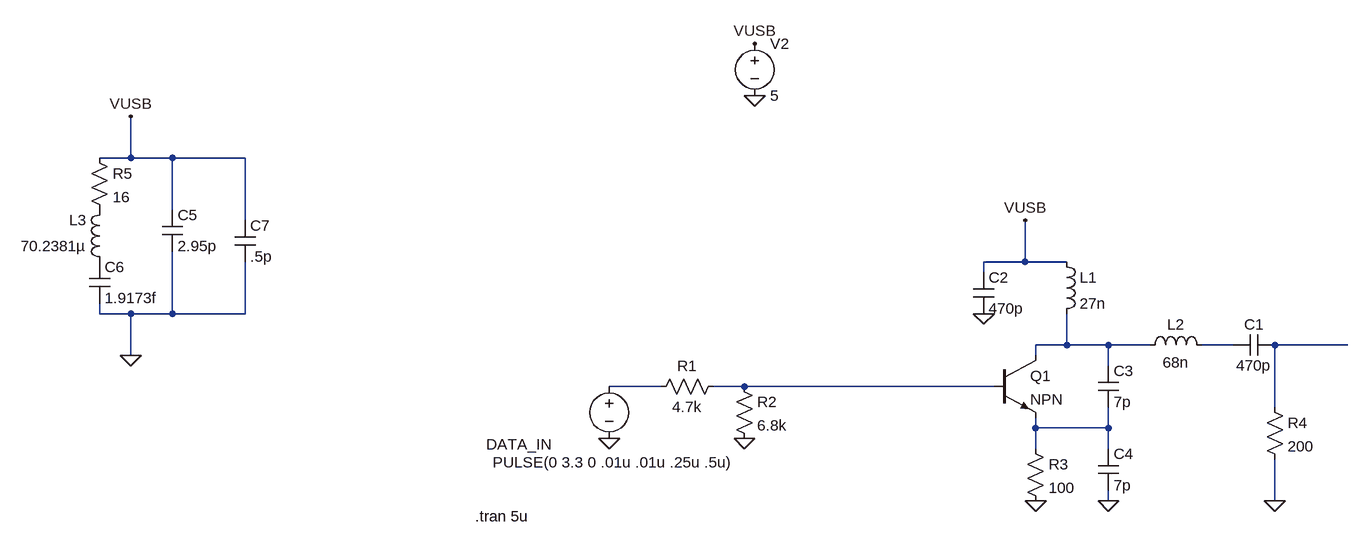
[diagram p0: schematic OOK_mod.asc]
OOK_mod.asc, the LTspice schematic file:
Version 4
SHEET 1 964 680
WIRE -912 48 -912 -16
WIRE -912 48 -960 48
WIRE -848 48 -912 48
WIRE -736 48 -848 48
WIRE -848 128 -848 48
WIRE -736 144 -736 48
WIRE 464 208 464 144
WIRE 464 208 400 208
WIRE 528 208 464 208
WIRE 400 224 400 208
WIRE -960 288 -960 272
WIRE -912 288 -960 288
WIRE -848 288 -848 192
WIRE -848 288 -912 288
WIRE -736 288 -736 208
WIRE -736 288 -848 288
WIRE 528 336 528 288
WIRE 528 336 480 336
WIRE 592 336 528 336
WIRE 656 336 592 336
WIRE 784 336 736 336
WIRE 960 336 848 336
WIRE -912 352 -912 288
WIRE 480 352 480 336
WIRE 592 368 592 336
WIRE -96 400 -176 400
WIRE 32 400 -16 400
WIRE 416 400 32 400
WIRE 848 432 848 336
WIRE 480 464 480 448
WIRE 592 464 592 432
WIRE 592 464 480 464
WIRE 480 496 480 464
WIRE 592 496 592 464
WIRE 592 576 592 560
WIRE 848 576 848 512
FLAG 32 480 0
FLAG -176 480 0
FLAG 480 576 0
FLAG 592 576 0
FLAG 400 288 0
FLAG 848 576 0
FLAG 48 -48 0
FLAG 48 -128 VUSB
FLAG 464 144 VUSB
FLAG -912 352 0
FLAG -912 -16 VUSB
SYMBOL npn2 416 352 R0
SYMATTR InstName Q1
SYMBOL res 0 384 R90
WINDOW 0 0 56 VBottom 2
WINDOW 3 32 56 VTop 2
SYMATTR InstName R1
SYMATTR Value 4.7k
SYMBOL res 16 384 R0
SYMATTR InstName R2
SYMATTR Value 6.8k
SYMBOL res 464 480 R0
SYMATTR InstName R3
SYMATTR Value 100
SYMBOL res 832 416 R0
SYMATTR InstName R4
SYMATTR Value 200
SYMBOL cap 848 320 R90
WINDOW 0 0 32 VBottom 2
WINDOW 3 32 32 VTop 2
SYMATTR InstName C1
SYMATTR Value 470p
SYMBOL cap 384 224 R0
SYMATTR InstName C2
SYMATTR Value 470p
SYMBOL cap 576 368 R0
SYMATTR InstName C3
SYMATTR Value 7p
SYMBOL cap 576 496 R0
SYMATTR InstName C4
SYMATTR Value 7p
SYMBOL ind 512 192 R0
SYMATTR InstName L1
SYMATTR Value 27n
SYMBOL ind 640 352 R270
WINDOW 0 32 56 VTop 2
WINDOW 3 5 56 VBottom 2
SYMATTR InstName L2
SYMATTR Value 68n
SYMBOL voltage -176 384 R0
WINDOW 0 -88 105 Right 2
WINDOW 3 -179 133 Left 2
WINDOW 123 0 0 Left 2
WINDOW 39 0 0 Left 2
SYMATTR InstName DATA_IN
SYMATTR Value PULSE(0 3.3 0 .01u .01u .25u .5u)
SYMBOL voltage 48 -144 R0
WINDOW 123 0 0 Left 2
WINDOW 39 0 0 Left 2
SYMATTR InstName V2
SYMATTR Value 5
SYMBOL res -976 32 R0
SYMATTR InstName R5
SYMATTR Value 16
SYMBOL ind -944 224 R180
WINDOW 0 36 80 Left 2
WINDOW 3 36 40 Left 2
SYMATTR InstName L3
SYMATTR Value 70.2381µ
SYMBOL cap -864 128 R0
SYMATTR InstName C5
SYMATTR Value 2.95p
SYMBOL cap -976 208 R0
SYMATTR InstName C6
SYMATTR Value 1.9173f
SYMBOL cap -752 144 R0
SYMATTR InstName C7
SYMATTR Value .5p
TEXT -382 600 Left 2 !.tran 5u

The netlist it stands for:
* OOK_mod.asc
Q1 N001 N005 N006 0 NPN
R1 N005 N004 4.7k
R2 N005 0 6.8k
R3 N006 0 100
R4 N003 0 200
C1 N003 N002 470p
C2 VUSB 0 470p
C3 N001 N006 7p
C4 N006 0 7p
L1 VUSB N001 27n
L2 N001 N002 68n
V§DATA_IN N004 0 PULSE(0 3.3 0 .01u .01u .25u .5u)
V2 VUSB 0 5
R5 VUSB P001 16
L3 P002 P001 70.2381µ
C5 VUSB 0 2.95p
C6 P002 0 1.9173f
C7 VUSB 0 .5p
.model NPN NPN
.model PNP PNP
.lib standard.bjt
.tran 5u
.backanno
.end